# EAGLE design cansat wiring v2 (EAGLE 9.6.2)
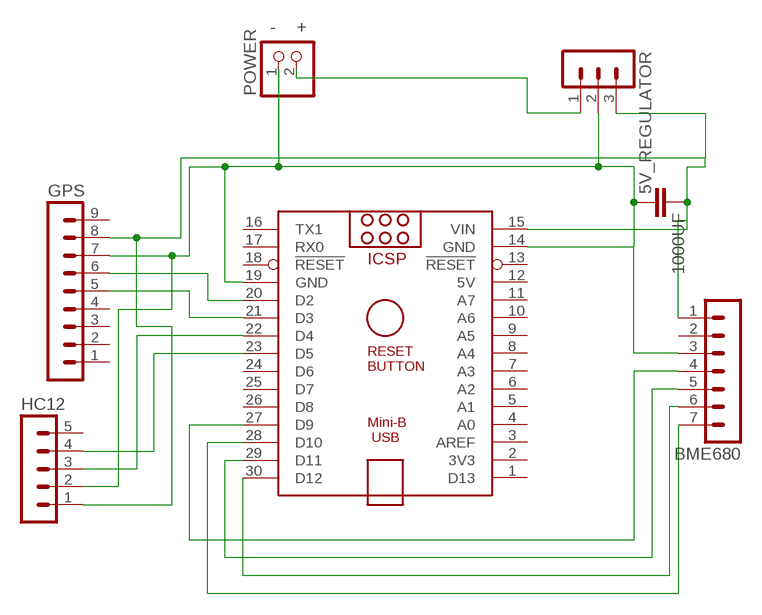
[diagram p0: schematic, sheet 1]

## Parts
5V_REGULATOR  MA03-1  [MA03-1]
1000UF  C2.5/2  [C2.5-2]
ARDUINO_NANO1  ARDUINO_NANO  [ARDUINO_NANO]
BME680  MA07-1  [MA07-1]
GPS  MA09-1  [MA09-1]
HC12  MA05-1  [MA05-1]
POWER  PINHD-1X2  [1X02]

## Nets
+: 5V_REGULATOR.2 1000UF.2 ARDUINO_NANO1.14(GND) ARDUINO_NANO1.19(GND) BME680.3 GPS.7 HC12.2 POWER.1
-: 5V_REGULATOR.1 POWER.2
N$1: ARDUINO_NANO1.27(D9) BME680.4
N$2: ARDUINO_NANO1.29(D11) BME680.5
N$3: ARDUINO_NANO1.20(D2) GPS.6
N$4: 5V_REGULATOR.3 1000UF.1 ARDUINO_NANO1.15(VIN) BME680.1 GPS.8 HC12.1
N$5: ARDUINO_NANO1.21(D3) GPS.5
N$6: ARDUINO_NANO1.30(D12) BME680.6
N$7: ARDUINO_NANO1.23(D5) HC12.4
N$8: ARDUINO_NANO1.28(D10) BME680.7
N$9: ARDUINO_NANO1.22(D4) HC12.3
Unconnected: ARDUINO_NANO1.1(D13) ARDUINO_NANO1.2(3V3) ARDUINO_NANO1.3(AREF) ARDUINO_NANO1.4(A0) ARDUINO_NANO1.5(A1) ARDUINO_NANO1.6(A2) ARDUINO_NANO1.7(A3) ARDUINO_NANO1.8(A4) ARDUINO_NANO1.9(A5) ARDUINO_NANO1.10(A6) ARDUINO_NANO1.11(A7) ARDUINO_NANO1.13(!RESET) ARDUINO_NANO1.16(TX1) ARDUINO_NANO1.17(RX0) ARDUINO_NANO1.18(!RESET) ARDUINO_NANO1.24(D6) ARDUINO_NANO1.25(D7) ARDUINO_NANO1.26(D8) BME680.2 GPS.1 GPS.2 GPS.3 GPS.4 GPS.9 HC12.5

## Power pins joined to a net without a drawn wire
5V: ARDUINO_NANO1.12(5V)

## Library data of the parts
5V_REGULATOR = con-lstb:MA03-1: PIN HEADER; OC_FARNELL: unknown; OC_NEWARK: unknown
1000UF = capacitor-wima:C: CAPACITOR naming: grid - package width
ARDUINO_NANO1 = ArduinoNanoV30:ARDUINO_NANO: Arduino Nano V3.0 Overview: The Arduino Nano is a small, complete, and breadboard-friendly board based on the ATmega328 (Arduino Nano 3.x) or ATmega168 (Arduino Nano 2.x). It has more or less the same functionality of the Arduino Duemilanove, but in a different package. It lacks only a DC power jack, and works with a Mini-B USB cable instead of a standard one. The Nano was designed and is being produced by Gravitech. Specifications: Microcontroller Atmel ATmega168 or ATmega328 Operating Voltage (logic level) 5 V Input Voltage (recommended) 7-12 V Input Voltage (limits) 6-20 V Digital I/O Pins 14 (of which 6 provide PWM output) Analog Input Pins 8 DC Current per I/O Pin 40 mA Flash Memory 16 KB (ATmega168) or 32 KB (ATmega328) of which 2 KB used by bootloader SRAM 1 KB (ATmega168) or 2 KB (ATmega328) EEPROM 512 bytes (ATmega168) or 1 KB (ATmega328) Clock Speed 16 MHz Dimensions 0.73" x 1.70" Length 45 mm Width 18 mm Weigth 5 g Power: The Arduino Nano can be powered via the Mini-B USB connection, 6-20V unregulated external power supply (pin 30), or 5V regulated external power supply (pin 27). The power source is automatically selected to the highest voltage source. Memory: The ATmega168 has 16 KB of flash memory for storing code (of which 2 KB is used for the bootloader); the ATmega328 has 32 KB, (also with 2 KB used for the bootloader). The ATmega168 has 1 KB of SRAM and 512 bytes of EEPROM (which can be read and written with the EEPROM library); the ATmega328 has 2 KB of SRAM and 1 KB of EEPROM. Input and Output: Each of the 14 digital pins on the Nano can be used as an input or output, using pinMode(), digitalWrite(), and digitalRead() functions. They operate at 5 volts. Each pin can provide or receive a maximum of 40 mA and has an internal pull-up resistor (disconnected by default) of 20-50 kOhms. In addition, some pins have specialized functions. Visit Arduino - ArduinoBoardNano <https://www.arduino.cc/en/Main/ArduinoBoardNano>
BME680 = con-lstb:MA07-1: PIN HEADER; OC_FARNELL: unknown; OC_NEWARK: unknown
GPS = con-lstb:MA09-1: PIN HEADER; OC_FARNELL: unknown; OC_NEWARK: unknown
HC12 = con-lstb:MA05-1: PIN HEADER; OC_FARNELL: unknown; OC_NEWARK: unknown
POWER = pinhead:PINHD-1X2: PIN HEADER

## Board
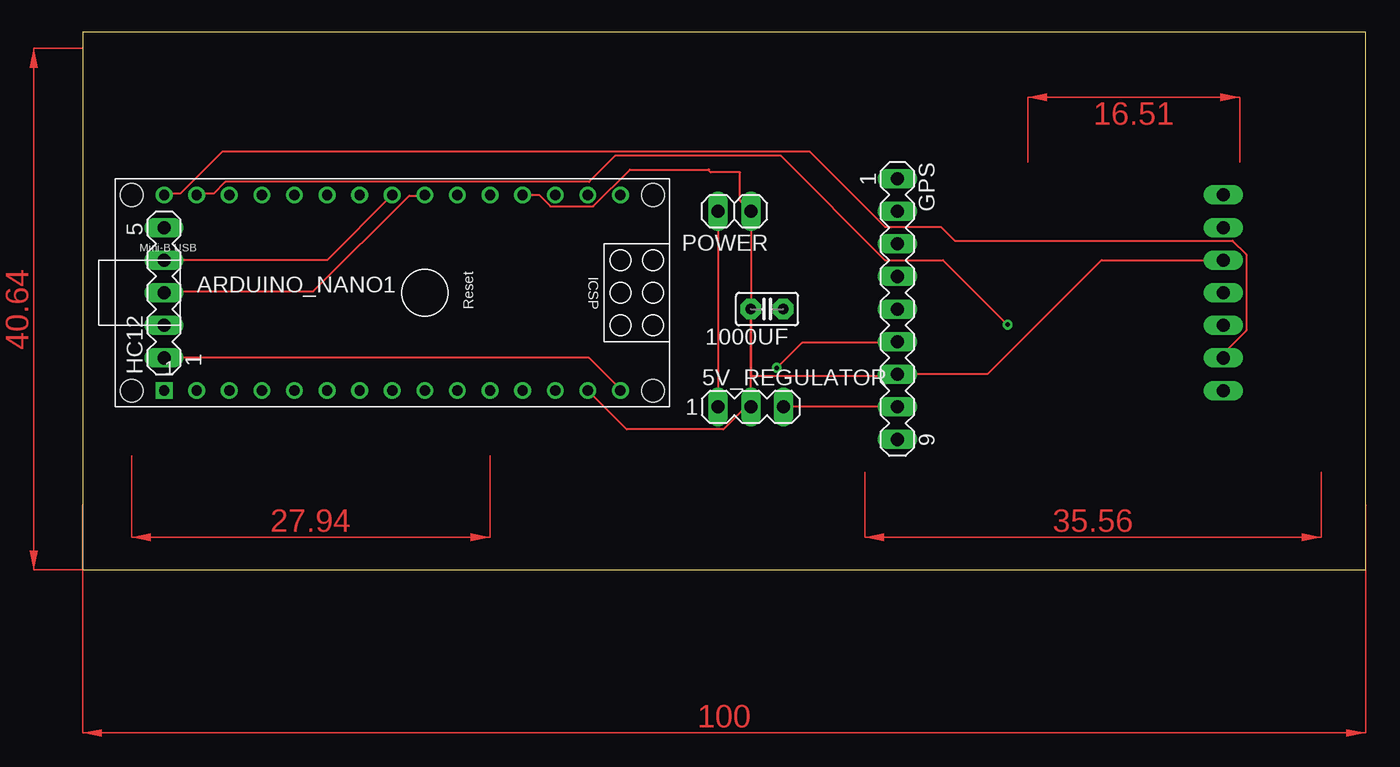
[diagram p1: board, top side]
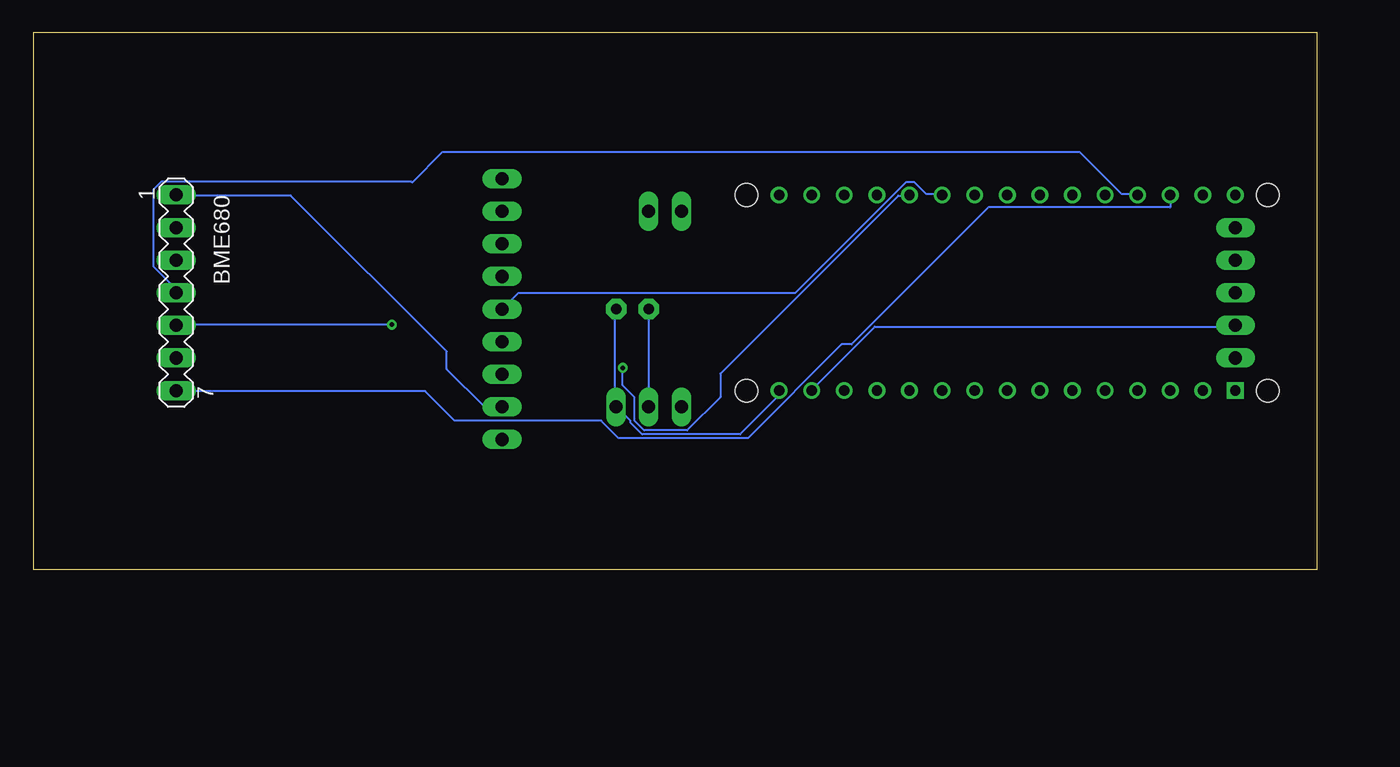
[diagram p2: board, bottom side, seen from below]

Size 100 x 41.9 mm. Coordinates in mm from the lower left corner, seen from the top.
Outline: 0,0 100,0 100,41.9 0,41.9 0,0
Copper layers (1*16): Top 0.035mm / dielectric 1.5mm / Bottom 0.035mm
Design rules "default": minimum track width 6mil, minimum drill 0.35mm, track to track 6mil, track to pad 6mil, pad to pad 6mil, via to via 6mil, smd to smd 6mil, copper to edge 40mil, drill to drill 6mil, minimum pad ring 10mil, minimum via ring 8mil, stop-mask expansion 4mil, vias tented up to drill 0mil, thermal gap 10mil

### Footprints (pad centres in the part's own frame; a part is rotated, then mirrored left to right if it is on the bottom)
MA03-1 = drill 1.016 long: 1 -2.54,0; 2 0,0; 3 2.54,0
C2.5-2 = drill 0.813 pad 1.6 octagon: 1 -1.27,0; 2 1.27,0
ARDUINO_NANO = drill 0.8 square: 1 -20.32,-7.62 | drill 0.8: 2 -17.78,-7.62; 3 -15.24,-7.62; 4 -12.7,-7.62; 5 -10.16,-7.62; 6 -7.62,-7.62; 7 -5.08,-7.62; 8 -2.54,-7.62; 9 0,-7.62; 10 2.54,-7.62; 11 5.08,-7.62; 12 7.62,-7.62; 13 10.16,-7.62; 14 12.7,-7.62; 15 15.24,-7.62; 16 15.24,7.62; 17 12.7,7.62; 18 10.16,7.62; 19 7.62,7.62; 20 5.08,7.62; 21 2.54,7.62; 22 0,7.62; 23 -2.54,7.62; 24 -5.08,7.62; 25 -7.62,7.62; 26 -10.16,7.62; 27 -12.7,7.62; 28 -15.24,7.62; 29 -17.78,7.62; 30 -20.32,7.62 | hole 1.778: -22.86,-7.62; -22.86,7.62; 17.78,7.62; 17.78,-7.62
MA07-1 = drill 1.016 long: 1 -7.62,0; 2 -5.08,0; 3 -2.54,0; 4 0,0; 5 2.54,0; 6 5.08,0; 7 7.62,0
MA09-1 = drill 1.016 long: 1 -10.16,0; 2 -7.62,0; 3 -5.08,0; 4 -2.54,0; 5 0,0; 6 2.54,0; 7 5.08,0; 8 7.62,0; 9 10.16,0
MA05-1 = drill 1.016 long: 1 -5.08,0; 2 -2.54,0; 3 0,0; 4 2.54,0; 5 5.08,0
1X02 = drill 1.016 long: 1 -1.27,0; 2 1.27,0

### Placement (x,y rotation side)
5V_REGULATOR  52.07,12.7 0 top
1000UF  53.34,20.32 180 top
ARDUINO_NANO1  26.67,21.59 0 top
BME680  88.9,21.59 270 bottom
GPS  63.5,20.32 270 top
HC12  6.35,21.59 90 top
POWER  50.8,27.94 180 top

### Tracks (layer width: path | path; a pad name or v marks a point on that pad's centre or on a via)
+
  Top 0.152: 52.07,15.14 63.45,15.14 GPS.7 63.6,15.29 70.56,15.29 79.4,24.13 BME680.3 | 5V_REGULATOR.2 52.07,15.14 | ARDUINO_NANO1.19 35.58,29.21 36.46,28.33 39.78,28.33 42.64,31.19 48.77,31.19 | 48.77,31.19 48.82,31.19 | 48.82,31.19 | 48.77,31.19 48.77,31.14 48.95,30.96 51.23,30.96 51.23,28.78 POWER.1 1000UF.2 | 1000UF.2 52.07,15.14 | 5V_REGULATOR.2 1000UF.2 | 5V_REGULATOR.2 51.69,12.7 49.94,10.95 42.39,10.95 ARDUINO_NANO1.14
  Bottom 0.152: 51.97,12.7 5V_REGULATOR.2 | HC12.2 6.45,18.95 34.44,18.95 39.32,14.07 ARDUINO_NANO1.14 | 1000UF.2 52.07,12.8
-
  Top 0.152: POWER.2 5V_REGULATOR.1
N$1
  Bottom 0.152: ARDUINO_NANO1.27 14.02,29.31 15.24,29.31 18.49,32.56 68.12,32.56 70.51,30.17 70.56,30.23 90.07,30.23 90.68,29.62 90.68,23.67 89,22 89,21.69 BME680.4
N$2  (via drill 0.35)
  Top 0.152: ARDUINO_NANO1.29 8.99,29.31 10.21,29.31 11.12,30.23 39.47,30.23 41.5,32.26 54.41,32.26 62.53,24.13 67.06,24.13 v72.08,19.1
  Bottom 0.152: v72.08,19.1 88.85,19.1 BME680.5
N$3  (via drill 0.35)
  Top 0.152: v54.1,15.75 56.08,17.73 63.4,17.73 GPS.6
  Bottom 0.152: ARDUINO_NANO1.20 31.85,29.16 32.61,29.16 46.48,15.29 46.48,13.46 49.07,10.87 52.43,10.87 53.19,11.63 53.19,13.46 54.1,14.38 v54.1,15.75 | 63.45,17.88 GPS.6
N$4
  Top 0.152: GPS.8 5V_REGULATOR.3 | HC12.1 39.47,16.51 41.91,14.07 ARDUINO_NANO1.15
  Bottom 0.152: GPS.8 64.87,12.7 67.82,15.65 67.82,17.02 79.96,29.16 88.85,29.16 BME680.1 | 1000UF.1 54.71,20.32 54.71,12.7 5V_REGULATOR.3 54.56,12.7 53.49,11.63 53.49,11.48 52.58,10.57 44.96,10.57 41.91,13.61 ARDUINO_NANO1.15
N$5
  Bottom 0.152: GPS.5 62.23,21.59 40.64,21.59 32,30.23 31.39,30.23 30.48,29.31 29.26,29.31 ARDUINO_NANO1.21
N$6
  Top 0.152: ARDUINO_NANO1.30 6.4,29.31 7.62,29.31 10.87,32.56 56.69,32.56 62.53,26.72 66.9,26.72 67.97,25.65 89.61,25.65 90.68,24.59 90.68,18.64 89,16.97 89,16.51 BME680.6
N$7
  Top 0.152: HC12.4 19.05,24.13 ARDUINO_NANO1.23
N$8
  Bottom 0.152: ARDUINO_NANO1.28 11.43,28.24 25.6,28.24 36.27,17.58 37.03,17.58 44.35,10.26 54.41,10.26 55.78,11.63 67.21,11.63 69.49,13.92 88.85,13.92 BME680.7
N$9
  Top 0.152: ARDUINO_NANO1.22 26.67,29.16 25.45,29.16 17.98,21.69 6.45,21.69 HC12.3
(copper drawn outside any net)
  shapes: Top area x5